# Altium project Nwatch.PrjPcb
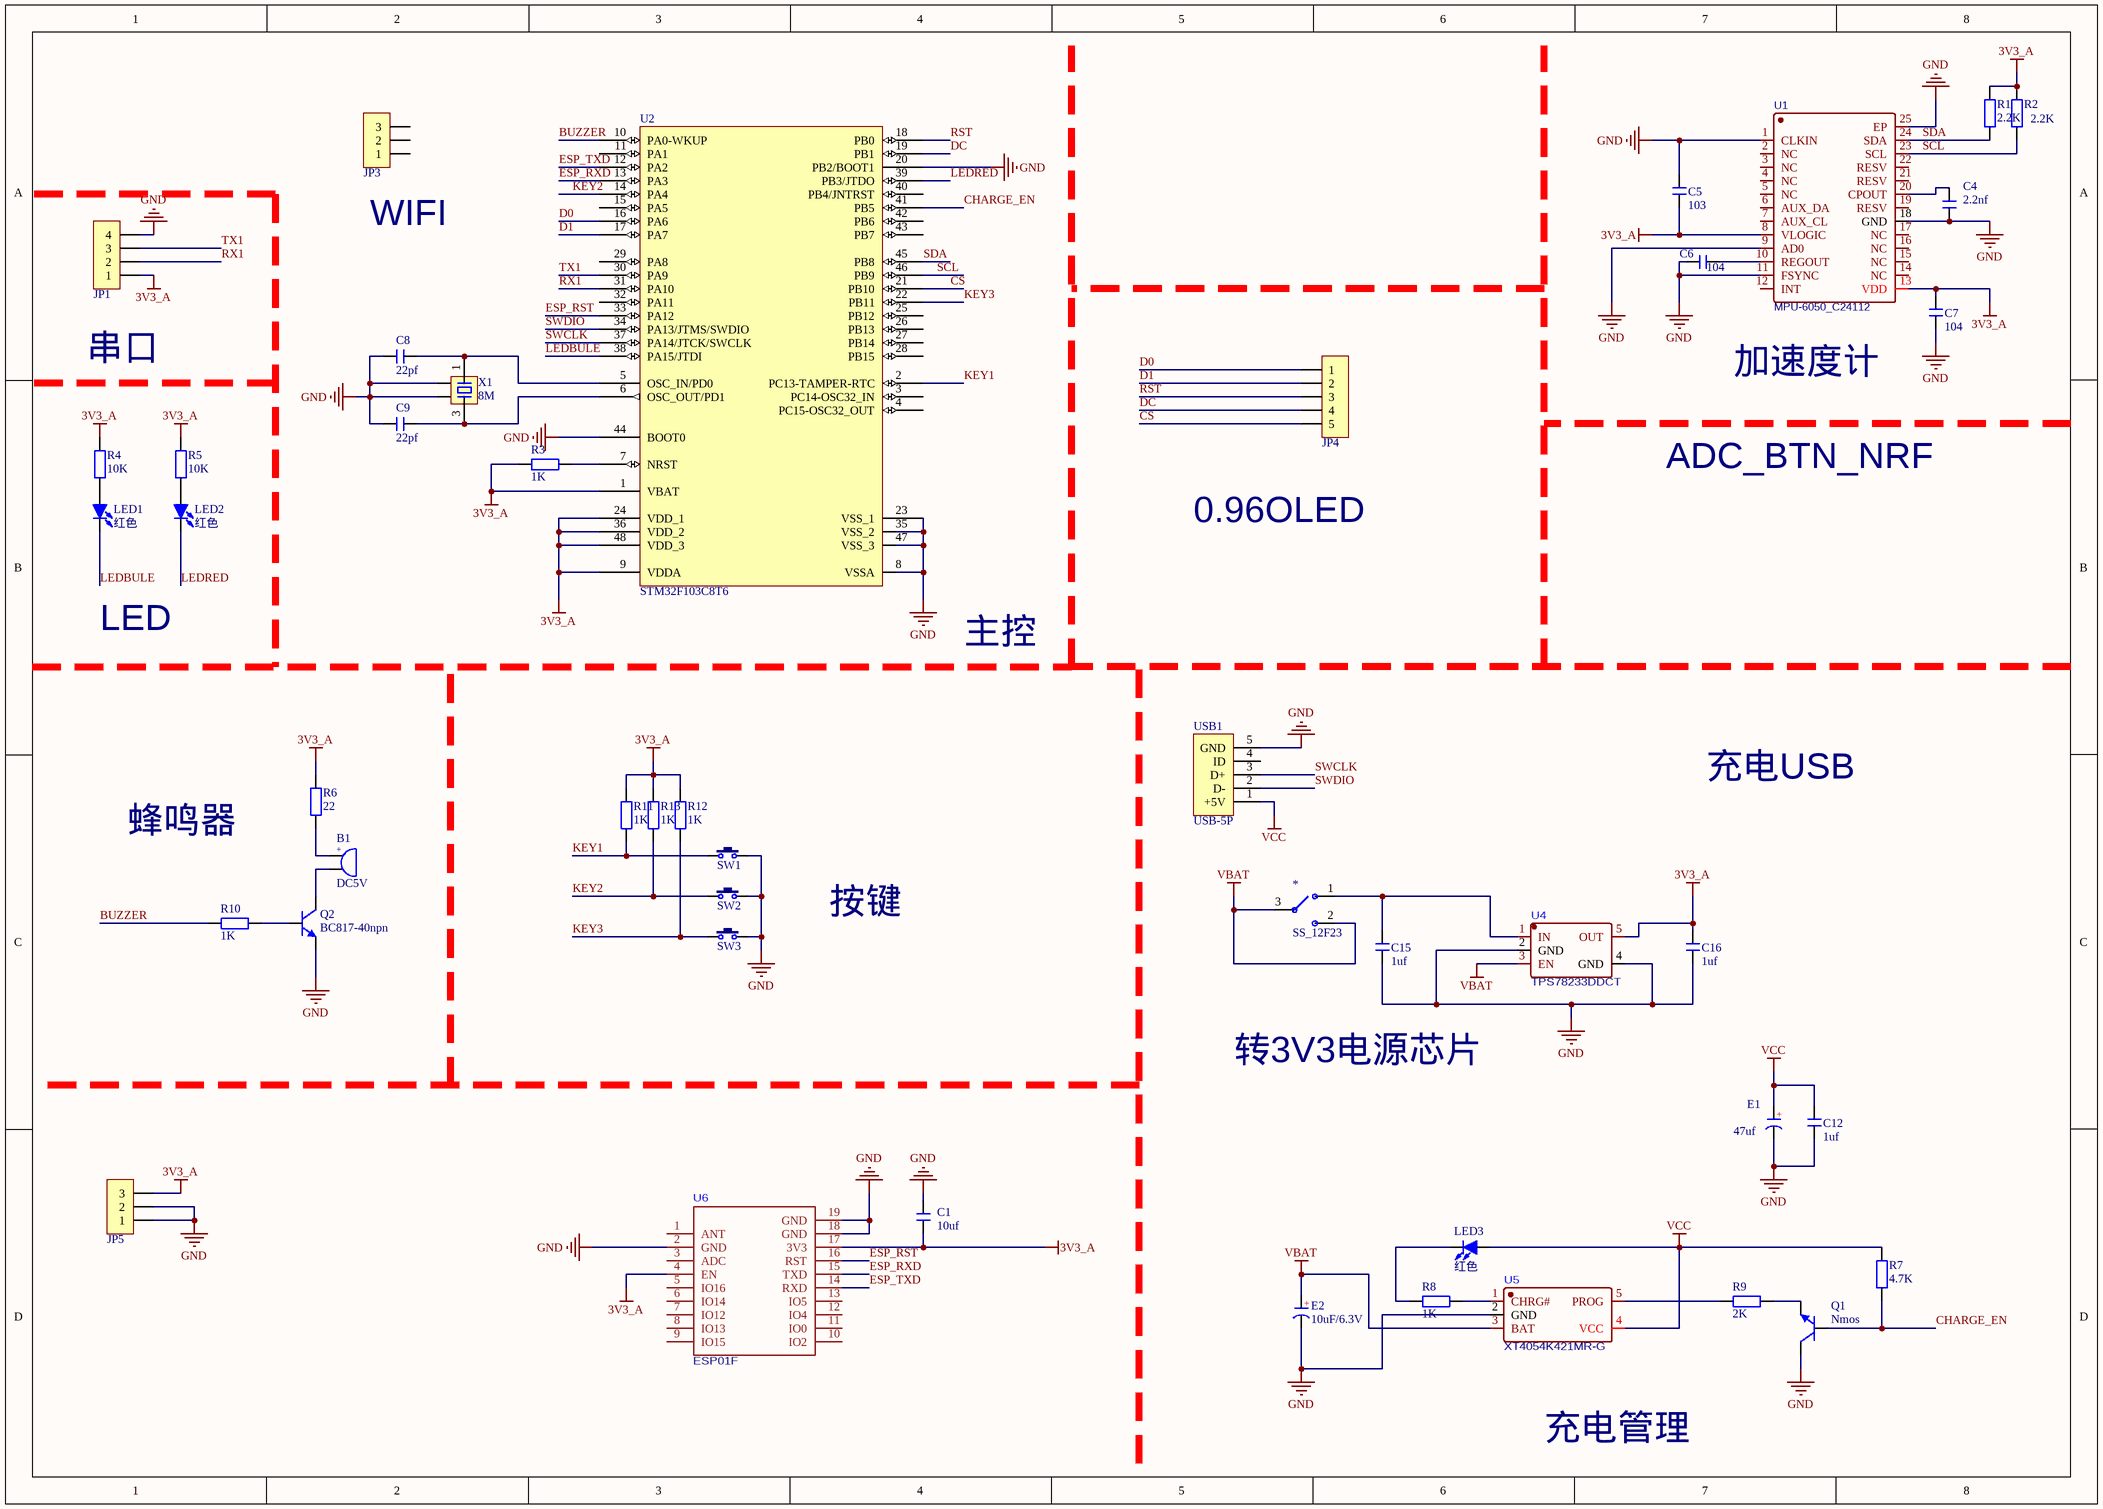
[diagram p0: Sheet1.SchDoc]
2 sheets, 64 parts. Net scope: global (net labels, ports and power ports of the same name join across sheets).
Board files: PCB3.PcbDoc, PCB1.PcbDoc
Sheets:
  Sheet1.SchDoc
  oled.SchDoc

## Sheet Sheet1.SchDoc
size A3

### Parts
*  SS_12F23  [SS_12F23]
B1  DC5V  [蜂鸣器5020]
C1  10uf  [C 0805]
C4  2.2nf  [C 0603]
C5  103  [C 0603]
C6  104  [C 0603]
C7  104  [C 0603]
C8  22pf  [C 0603]
C9  22pf  [C 0603]
C12  1uf  [C 0603]
C15  1uf  [C 0603]
C16  1uf  [C 0603]
E1  47uf  [CD A(3216)]
E2  10uF/6.3V  [CD A(3216)]
JP1  HDR-1X4  [uart_pin]  (value not drawn)
JP3  HDR-1X3  [OLED_3PIN]  (value not drawn)
JP4  HDR-1X5  [OLED_5PIN]  (value not drawn)
JP5  HDR-1X3  [OLED_3PIN]  (value not drawn)
LED1  红色  [LED 0603G]
LED2  红色  [LED 0603G]
LED3  红色  [LED 0603G]
Q1  Nmos  [NMOS]
Q2  BC817-40npn  [SOT23-3N]
R1  2.2K  [R 0603]
R2  2.2K  [R 0603]
R3  1K  [R 0603]
R4  10K  [R 0603]
R5  10K  [R 0603]
R6  22  [R 0603]
R7  4.7K  [R 0603]
R8  1K  [R 0603]
R9  2K  [R 0603]
R10  1K  [R 0603]
R11  1K  [R 0603]
R12  1K  [R 0603]
R13  1K  [R 0603]
SW1  3x6x5  [SB-2*4*3.5]  (value not drawn)
SW2  3x6x5  [SB-2*4*3.5]  (value not drawn)
SW3  3x6x5  [SB-2*4*3.5]  (value not drawn)
U1  MPU-6050_C24112  [MPU6050]
U2  STM32F103C8T6  [LQFP48 7X7_M]
U4  TPS78233DDCT  [SOT-23-5_L3.0-W1.7-P0.95-LS2.8-BR]
U5  XT4054K421MR-G  [SOT-23-5_L3.0-W1.7-P0.95-LS2.8-BR]
U6  ESP01F  [ESP-01F]
USB1  USB-5P  [MICRO-USB]
X1  8M  [OSC-SMD_4P-L3.2-W2.5-BL]

### Nets
3V3_A: C1.1 C5.1 C7.2 C16.2 JP1.1 JP5.3 R1.2 R2.2 R3.2 R4.2 R5.2 R6.2 R11.1 R12.1 R13.1 U1.8(VLOGIC) U1.13(VDD) U2.1(VBAT) U2.9(VDDA) U2.24(VDD_1) U2.36(VDD_2) U2.48(VDD_3) U4.5(OUT) U6.4(EN) U6.17(3V3)
GND: C1.2 C4.2 C5.2 C6.1 C7.1 C8.1 C9.1 C12.1 C15.1 C16.1 E1.2(K) E2.2(K) JP1.4 JP5.1 JP5.2 Q1.3(C) Q2.2(E) SW1.2 SW2.2 SW3.2 U1.1(CLKIN) U1.9(AD0) U1.11(FSYNC) U1.18(GND) U1.25(EP) U2.8(VSSA) U2.20(PB2/BOOT1) U2.23(VSS_1) U2.35(VSS_2) U2.44(BOOT0) U2.47(VSS_3) U4.2(GND) U4.4(GND) U5.2(GND) U6.2(GND) U6.18(GND) U6.19(GND) USB1.5(GND) X1.2 X1.4
VBAT: *.2 *.3 E2.1(A) U4.3(EN) U5.3(BAT)
VCC: C12.2 E1.1(A) LED3.1(A) R7.1 U5.4(VCC) USB1.1(+5V)
BUZZER: R10.2 U2.10(PA0-WKUP)
CHARGE_EN: Q1.1(B) R7.2 U2.41(PB5)
CS: JP4.5 U2.21(PB10)
D0: JP4.1 U2.16(PA6)
D1: JP4.2 U2.17(PA7)
DC: JP4.4 U2.19(PB1)
ESP_RST: U2.33(PA12) U6.16(RST)
ESP_RXD: U2.13(PA3) U6.15(TXD)
ESP_TXD: U2.12(PA2) U6.14(RXD)
KEY1: R11.2 SW1.1 U2.2(PC13-TAMPER-RTC)
KEY2: R13.2 SW2.1 U2.14(PA4)
KEY3: R12.2 SW3.1 U2.22(PB11)
LEDBULE: LED1.2(K) U2.38(PA15/JTDI)
LEDRED: LED2.2(K) U2.39(PB3/JTDO)
RST: JP4.3 U2.18(PB0)
RX1: JP1.2 U2.31(PA10)
SCL: R2.1 U1.23(SCL) U2.46(PB9)
SDA: R1.1 U1.24(SDA) U2.45(PB8)
SWCLK: U2.37(PA14/JTCK/SWCLK) USB1.3(D+)
SWDIO: U2.34(PA13/JTMS/SWDIO) USB1.2(D-)
TX1: JP1.3 U2.30(PA9)
Net*_1: *.1 C15.2 U4.1(IN)
NetB1_1: B1.1 R6.1
NetB1_2: B1.2 Q2.3(C)
NetC4_1: C4.1 U1.20(CPOUT)
NetC6_2: C6.2 U1.10(REGOUT)
NetC8_2: C8.2 U2.5(OSC_IN/PD0) X1.1
NetC9_2: C9.2 U2.6(OSC_OUT/PD1) X1.3
NetLED1_1: LED1.1(A) R4.1
NetLED2_1: LED2.1(A) R5.1
NetLED3_2: LED3.2(K) R8.2
NetQ1_2: Q1.2(E) R9.1
NetQ2_1: Q2.1(B) R10.1
NetR3_1: R3.1 U2.7(NRST)
NetR8_1: R8.1 U5.1(CHRG#)
NetR9_2: R9.2 U5.5(PROG)

Not connected (* = marked no-connect by the designer): JP3 1 2 3; U1 2(NC) 3(NC) 4(NC) 5(NC) 6(AUX_DA) 7(AUX_CL) 12(INT) 14(NC) 15(NC) 16(NC) 17(NC) 19(RESV) 21(RESV) 22(RESV); U2 3(PC14-OSC32_IN) 4(PC15-OSC32_OUT) 11(PA1) 15(PA5) 25(PB12) 26(PB13) 27(PB14) 28(PB15) 29(PA8) 32(PA11) 40(PB4/JNTRST) 42(PB6) 43(PB7); U6 1(ANT) 3(ADC) 5(IO16) 6(IO14) 7(IO12) 8(IO13) 9(IO15) 10(IO2) 11(IO0) 12(IO4) 13(IO5); USB1 4(ID)

### Notes on the sheet
- (near JP3) WIFI
- 串口
- 加速度计
- ADC_BTN_NRF
- 0.96OLED
- LED
- 主控
- 充电USB
- 蜂鸣器
- 按键
- 转3V3电源芯片
- 充电管理
- (in symbol BEEP) +
- (in symbol C-CD) +

### Library data of the parts
B1 = BEEP: 蜂鸣器; 版权归属: 黎明电子style; BOM名称: 蜂鸣器; 学习资源: https://lmdzstyle.taobao.com/
C1 C4-C9 C12 C15 C16 = C: 无极性贴片电容; 版权归属: 黎明电子style; BOM名称: 无极性贴片电容; 学习资源: https://lmdzstyle.taobao.com/
E1 E2 = C-CD: 贴片钽电容; 版权归属: 黎明电子style; BOM名称: 贴片钽电容; 学习资源: https://lmdzstyle.taobao.com/
JP1 = Header 4: 4P接插件; 版权归属: 黎明电子style; BOM名称: 4P接插件; 学习资源: https://lmdzstyle.taobao.com/
JP3 JP5 = Header 3: 3P接插件; 版权归属: 黎明电子style; BOM名称: 3P接插件; 学习资源: https://lmdzstyle.taobao.com/
JP4 = Header 5: 5P接插件; 版权归属: 黎明电子style; BOM名称: 5P接插件; 学习资源: https://lmdzstyle.taobao.com/
LED1-LED3 = LED-SMD: 贴片LED; 版权归属: 黎明电子style; BOM名称: 贴片LED; 学习资源: https://lmdzstyle.taobao.com/
Q1 = 9013-SMD: 低频放大-NPN型; 版权归属: 黎明电子style; 属性: 50V 0.5A 0.625W; BOM名称: 低频放大-NPN型; 学习资源: https://lmdzstyle.taobao.com/
Q2 = 8050-SMD: 高频放大-NPN型; 版权归属: 黎明电子style; 属性: 40V 1.5A 1W 100MHZ; BOM名称: 高频放大-NPN型; 学习资源: https://lmdzstyle.taobao.com/
R1-R13 = R: 贴片电阻; 版权归属: 黎明电子style; BOM名称: 贴片电阻; 学习资源: https://lmdzstyle.taobao.com/
SW1-SW3 = TSW 3x6: 3x6轻触开关; 版权归属: 黎明电子style; BOM名称: 3x6轻触开关; 学习资源: https://lmdzstyle.taobao.com/
U1 = MPU-6050_C24112: BOM_Manufacturer: InvenSense; sourceId: 1T5FDZYC8; timeStamp: 1462265206; BOM_Supplier: LCSC; BOM_Manufacturer Part: MPU-6050; image: //image.lceda.cn/szlcsc/C24112.jpg; BOM_Supplier Part: C24112; spicePre: U; spiceSymbolName: MPU-6050_C24112
U2 = STM32F103C8T6: Flaah:64/RAM:20/IO:36; BOM名称: 32位STM单片机; 版权归属: 黎明电子style; 学习资源: https://lmdzstyle.taobao.com/
USB1 = USB-5P: 微型USB母座; 版权归属: 黎明电子style; BOM名称: 微型USB母座; 学习资源: https://lmdzstyle.taobao.com/
X1 = XTAL-4: 4脚晶振; 版权归属: 源创客; BOM名称: 4脚晶振; 学习资源: www.ooocke.com

## Sheet oled.SchDoc
size A4
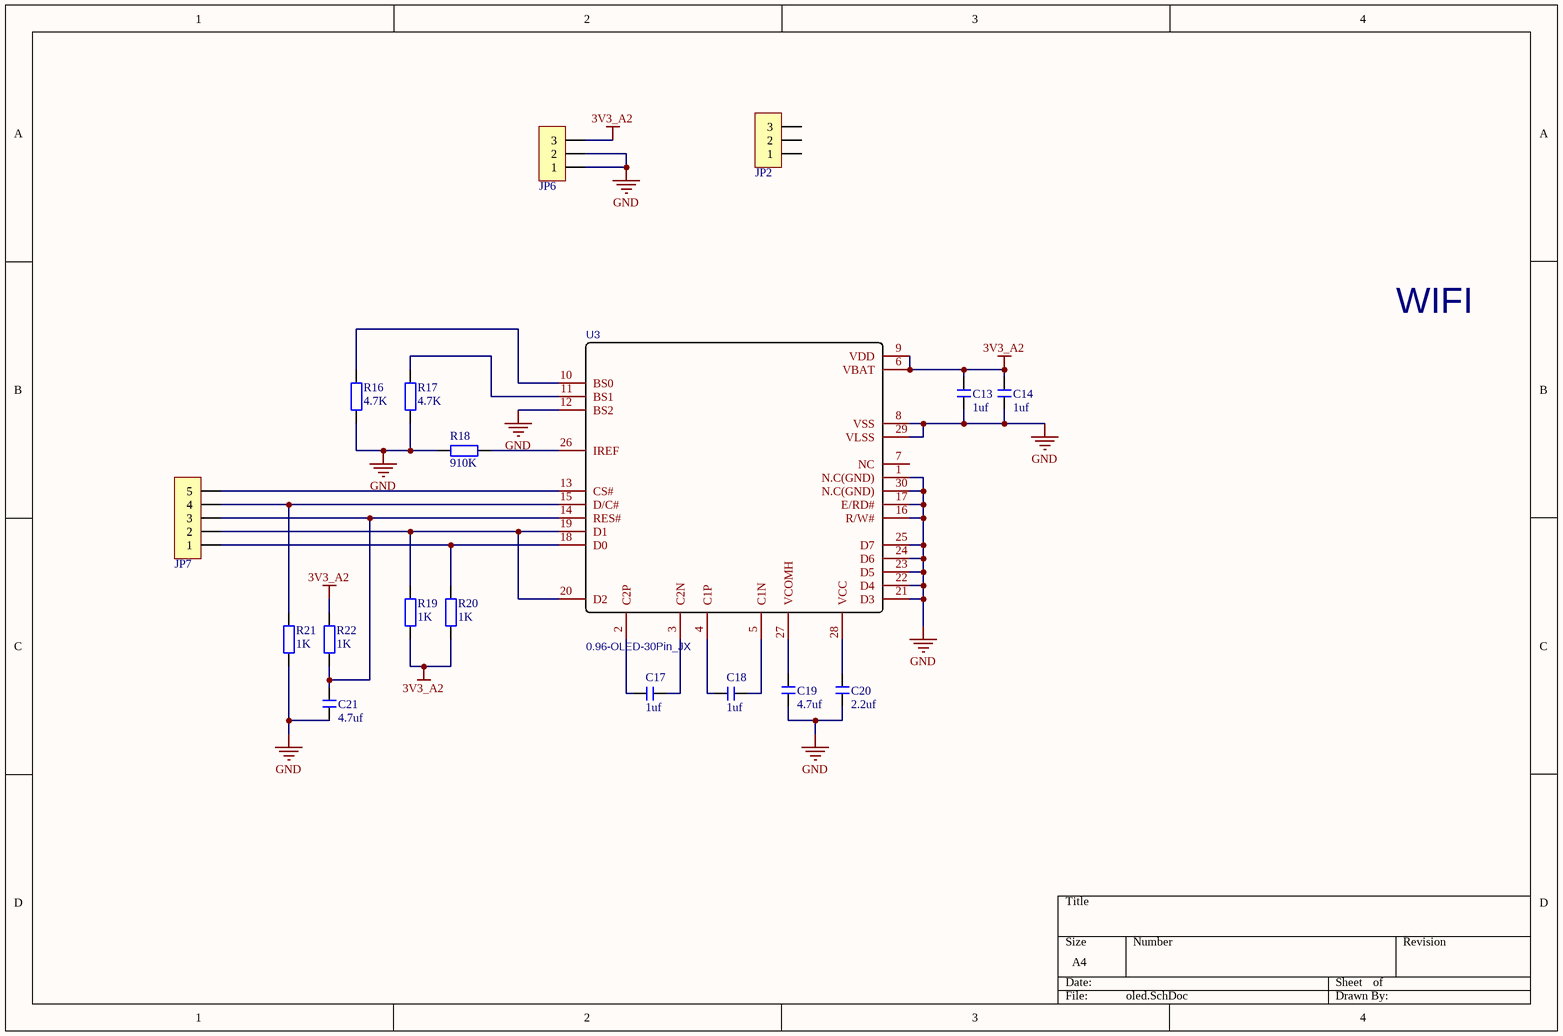
[diagram p1: oled.SchDoc]

### Parts
C13  1uf  [C 0603]
C14  1uf  [C 0603]
C17  1uf  [C 0603]
C18  1uf  [C 0603]
C19  4.7uf  [C 0603]
C20  2.2uf  [C 0603]
C21  4.7uf  [C 0603]
JP2  HDR-1X3  [OLED_3PIN]  (value not drawn)
JP6  HDR-1X3  [OLED_3PIN]  (value not drawn)
JP7  HDR-1X5  [OLED_5PIN]  (value not drawn)
R16  4.7K  [R 0603]
R17  4.7K  [R 0603]
R18  910K  [R 0603]
R19  1K  [R 0603]
R20  1K  [R 0603]
R21  1K  [R 0603]
R22  1K  [R 0603]
U3  0.96-OLED-30Pin_JX  [SSD1306-30PIN_JX]

### Nets
3V3_A2: C13.2 C14.2 JP6.3 R19.2 R20.2 R22.1 U3.6(VBAT) U3.9(VDD)
GND: C13.1 C14.1 C19.1 C20.1 C21.1 JP6.1 JP6.2 R16.2 R17.2 R18.1 R21.2 U3.1(N.C(GND)) U3.8(VSS) U3.12(BS2) U3.16(R/W#) U3.17(E/RD#) U3.21(D3) U3.22(D4) U3.23(D5) U3.24(D6) U3.25(D7) U3.29(VLSS) U3.30(N.C(GND))
NetC17_1: C17.1 U3.3(C2N)
NetC17_2: C17.2 U3.2(C2P)
NetC18_1: C18.1 U3.5(C1N)
NetC18_2: C18.2 U3.4(C1P)
NetC19_2: C19.2 U3.27(VCOMH)
NetC20_2: C20.2 U3.28(VCC)
NetC21_2: C21.2 JP7.3 R22.2 U3.14(RES#)
NetJP7_1: JP7.1 R20.1 U3.18(D0)
NetJP7_2: JP7.2 R19.1 U3.19(D1) U3.20(D2)
NetJP7_4: JP7.4 R21.1 U3.15(D/C#)
NetJP7_5: JP7.5 U3.13(CS#)
NetR16_1: R16.1 U3.10(BS0)
NetR17_1: R17.1 U3.11(BS1)
NetR18_2: R18.2 U3.26(IREF)

Not connected (* = marked no-connect by the designer): JP2 1 2 3; U3 7(NC)

### Notes on the sheet
- WIFI

### Library data of the parts
C13 C14 C17-C21 = C: 无极性贴片电容; 版权归属: 黎明电子style; BOM名称: 无极性贴片电容; 学习资源: https://lmdzstyle.taobao.com/
JP2 JP6 = Header 3: 3P接插件; 版权归属: 黎明电子style; BOM名称: 3P接插件; 学习资源: https://lmdzstyle.taobao.com/
JP7 = Header 5: 5P接插件; 版权归属: 黎明电子style; BOM名称: 5P接插件; 学习资源: https://lmdzstyle.taobao.com/
R16-R22 = R: 贴片电阻; 版权归属: 黎明电子style; BOM名称: 贴片电阻; 学习资源: https://lmdzstyle.taobao.com/
U3 = 0.96-OLED-30Pin_JX: spicePre: U; BOM_Supplier: LCSC

## Nets that join several sheets
GND: Sheet1 (40 pins), oled (23 pins)